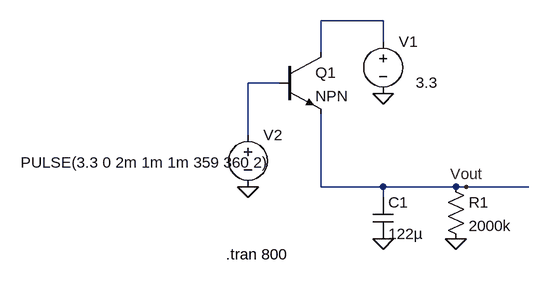
[diagram p0: schematic XbeeIO_timeConstant.asc]
XbeeIO_timeConstant.asc, the LTspice schematic file:
Version 4
SHEET 1 880 680
WIRE 64 -144 -32 -144
WIRE 64 -112 64 -144
WIRE -32 -96 -32 -144
WIRE -96 -48 -144 -48
WIRE -144 32 -144 -48
WIRE -32 112 -32 0
WIRE 64 112 -32 112
WIRE 176 112 64 112
WIRE 192 112 176 112
WIRE 288 112 192 112
WIRE 64 128 64 112
FLAG 192 112 Vout
FLAG -144 112 0
FLAG 64 192 0
FLAG 176 192 0
FLAG 64 -32 0
SYMBOL res 160 96 R0
SYMATTR InstName R1
SYMATTR Value 2000k
SYMBOL cap 48 128 R0
SYMATTR InstName C1
SYMATTR Value 122µ
SYMBOL voltage 64 -128 R0
WINDOW 3 50 79 Left 2
WINDOW 123 0 0 Left 2
WINDOW 39 0 0 Left 2
SYMATTR InstName V1
SYMATTR Value 3.3
SYMBOL npn -96 -96 R0
SYMATTR InstName Q1
SYMBOL voltage -144 16 R0
WINDOW 3 -350 58 Left 2
WINDOW 123 0 0 Left 2
WINDOW 39 0 0 Left 2
SYMATTR InstName V2
SYMATTR Value PULSE(3.3 0 2m 1m 1m 359 360 2)
TEXT -178 216 Left 2 !.tran 800

The netlist it stands for:
* XbeeIO_timeConstant.asc
R1 Vout 0 2000k
C1 Vout 0 122µ
V1 N001 0 3.3
Q1 N001 N002 Vout 0 NPN
V2 N002 0 PULSE(3.3 0 2m 1m 1m 359 360 2)
.model NPN NPN
.model PNP PNP
.lib standard.bjt
.tran 800
.backanno
.end